# Altium schematic sheet schemat.SchDoc
size A4
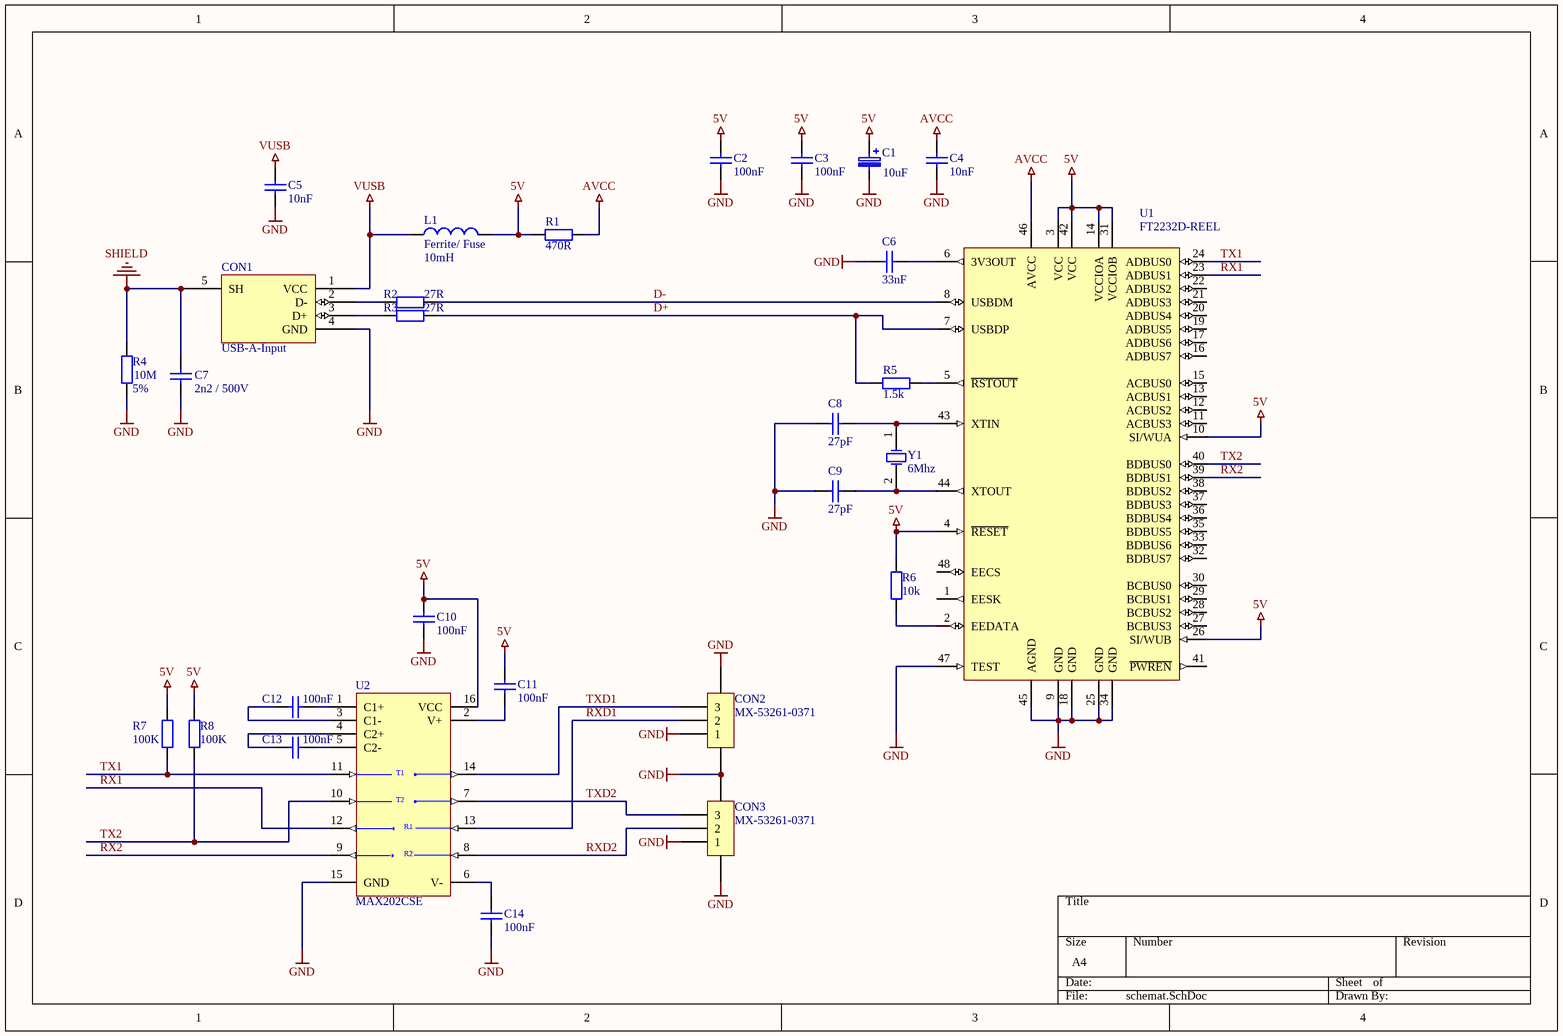
[diagram p0: schemat.SchDoc]

## Parts
C1  10uF  [SMDA]
C2  100nF  [CAPC1608N]
C3  100nF  [CAPC1608N]
C4  10nF  [CAPC1608N]
C5  10nF  [CAPC1608N]
C6  33nF  [CAPC1608N]
C7  2n2 / 500V  [CAPC3216N]
C8  27pF  [CAPC1608N]
C9  27pF  [CAPC1608N]
C10  100nF  [CAPC1608N]
C11  100nF  [CAPC1608N]
C12  100nF  [CAPC1608N]
C13  100nF  [CAPC1608N]
C14  100nF  [CAPC1608N]
CON1  USB-A-Input  [USB-A-input]
CON2  MX-53261-0371  [MX-53261-0371]
CON3  MX-53261-0371  [MX-53261-0371]
L1  Ferrite/ Fuse  value 10mH  [FERRITE_1206]
R1  470R  [RESC1608N]
R2  27R  [RESC1608N]
R3  27R  [RESC1608N]
R4  Tolerance: 5%  [RESC3216N]  (hidden comment: 10M)
R5  1.5k  [RESC1608N]
R6  10k  [RESC1608N]
R7  100K  [RESC1608N]
R8  100K  [RESC1608N]
U1  FT2232D-REEL  [LQFP-48_L]
U2  MAX202CSE  [TI-D16_L]
Y1  6Mhz  [HC-49U]

## Nets
5V: C1.1 C2.2 C3.2 C10.2 C11.2 L1.2 R1.1 R6.2 R7.2 R8.2 U1.3(VCC) U1.4(~{RESET}) U1.10(SI/WUA) U1.14(VCCIOA) U1.26(SI/WUB) U1.31(VCCIOB) U1.42(VCC) U2.16(VCC)
AVCC: C4.1 R1.2 U1.46(AVCC)
GND: C1.2 C2.1 C3.1 C4.2 C5.1 C6.2 C7.1 C8.2 C9.2 C10.1 C14.1 CON1.4(GND) CON2.1 CON2.4 CON2.5 CON3.1 CON3.4 CON3.5 R4.1 U1.9(GND) U1.18(GND) U1.25(GND) U1.34(GND) U1.45(AGND) U1.47(TEST) U2.15(GND)
SHIELD: C7.2 CON1.5(SH) R4.2
VUSB: C5.2 CON1.1(VCC) L1.1
D+: R3.1 R5.2 U1.7(USBDP)
D-: R2.1 U1.8(USBDM)
RX1: U1.23(ADBUS1) U2.12(R1OUT)
RX2: U1.39(BDBUS1) U2.9(R2OUT)
RXD1: CON2.2 U2.13(R1IN)
RXD2: CON3.2 U2.8(R2IN)
TX1: R7.1 U1.24(ADBUS0) U2.11(T1IN)
TX2: R8.1 U1.40(BDBUS0) U2.10(T2IN)
TXD1: CON2.3 U2.14(T1OUT)
TXD2: CON3.3 U2.7(T2OUT)
NetC6_1: C6.1 U1.6(3V3OUT)
NetC8_1: C8.1 U1.43(XTIN) Y1.1(OSC1)
NetC9_1: C9.1 U1.44(XTOUT) Y1.2(OSC2)
NetC11_1: C11.1 U2.2(V+)
NetC12_1: C12.1 U2.3(C1-)
NetC12_2: C12.2 U2.1(C1+)
NetC13_1: C13.1 U2.4(C2+)
NetC13_2: C13.2 U2.5(C2-)
NetC14_2: C14.2 U2.6(V-)
NetCON1_2: CON1.2(D-) R2.2
NetCON1_3: CON1.3(D+) R3.2
NetR5_1: R5.1 U1.5(~{RSTOUT})
NetR6_1: R6.1 U1.2(EEDATA)

Not connected (* = marked no-connect by the designer): U1 1(EESK) 11(ACBUS3) 12(ACBUS2) 13(ACBUS1) 15(ACBUS0) 16(ADBUS7) 17(ADBUS6) 19(ADBUS5) 20(ADBUS4) 21(ADBUS3) 22(ADBUS2) 27(BCBUS3) 28(BCBUS2) 29(BCBUS1) 30(BCBUS0) 32(BDBUS7) 33(BDBUS6) 35(BDBUS5) 36(BDBUS4) 37(BDBUS3) 38(BDBUS2) 41(~{PWREN}) 48(EECS)

## Notes on the sheet
- (in symbol MAX202CSE) T1; T2; R1; R2

## Library data of the parts
C1 = 100uF 6.3V-SMDB: Polarized Capacitor (Surface Mount); PackageReference: SMDB; Manufacturer: *; Manufacturer Part No.: *; Distributor: tme.pl; Distributor Order Code: TC 100/6.3-SMDB; tme.pl: TC 100/6.3-SMDB; Value: 10uF; farnell: 1135048
C2-C14 = Capacitor
  C2 C3 C10-C14: Value: 100nF
  C4 C5: Value: 10nF
  C6: Value: 33nF
  C7: Value: 2n2 / 500V
  C8 C9: Value: 27pF
CON2 CON3 = MX-53261-0371: Pitch 1.25mm, 3-pin; ComponentLink1Description: Manufacturer Link; ComponentLink2Description: Datasheet; Distributor: tme.pl; tme.pl: MX-6410-03A
L1 = Inductor: Code_IEC: 1005; Published: 8-Jun-2000; LatestRevisionDate: 29-May-2009; LatestRevisionNote: IPC-7351 Footprint Added.; PackageReference: 0402-A; Publisher: Altium Limited; PackageDescription: Chip Inductor; Code_JEITA: 0402
R1-R3 R5 R6 = Resistor: Tolerance: 5%; Power: 0W
  R1: Value: 470R
  R2 R3: Value: 27R
  R5: Value: 1.5k
  R6: Value: 10k
R4 = Resistor: Power: 0W; Value: 10M
R7 R8 = Resistor: Power: 0W; Tolerance: 5%; Value: 100K
U1 = COM-UART-FT2232D-SQ48: FT2232D Dual USB to Serial UART/FIFO IC, -40 to +85 degC, 48-Pin LQFP, Pb-Free, Tape and Reel; Manufacturer: FTDI; ComponentLink1Description: Manufacturer URL; ComponentLink1URL: http://www.ftdichip.com/; PackageDescription: 48-Pin Thin Quad Flat Pack, 7 x 7 mm Body, 0.5 mm Pitch; PackageVersion: Apr-11; PartNumber: FT2232D-REEL; ComponentLink2URL: http://www.ftdichip.com/Support/Documents/DataSheets/ICs/DS_FT2232D.pdf; ComponentLink2Description: Datasheet; PackageReference: LQFP-48; DatasheetVersion: ver 2.05, Apr-2011
U2 = MAX202CSE: +5V RS-232 Transceiver with 0.1µF External Capacitor; Published: 16-Jan-2001; LatestRevisionDate: 13-Apr-2006; LatestRevisionNote: IPC-7351 Footprint Added.; DatasheetVersion: Dec-1996; PackageReference: NSO16; Publisher: Altium Limited; PackageDescription: 16-Pin Small Outline Integrated Circuit 1.27 mm Pitch; Code_JEDEC: MS-012-AC; Code_IPC: SOIC127P600-16; ComponentLink1Description: Manufacturer Link; ComponentLink1URL: http://www.maxim-ic.com/; ComponentLink2Description: Datasheet; ComponentLink2URL: http://pdfserv.maxim-ic.com/en/ds/MAX200-MAX213.pdf
Y1 = XTAL: Crystal Oscillator; Value: 6Mhz